# EAGLE design RobomasterHub (EAGLE 9.6.2)
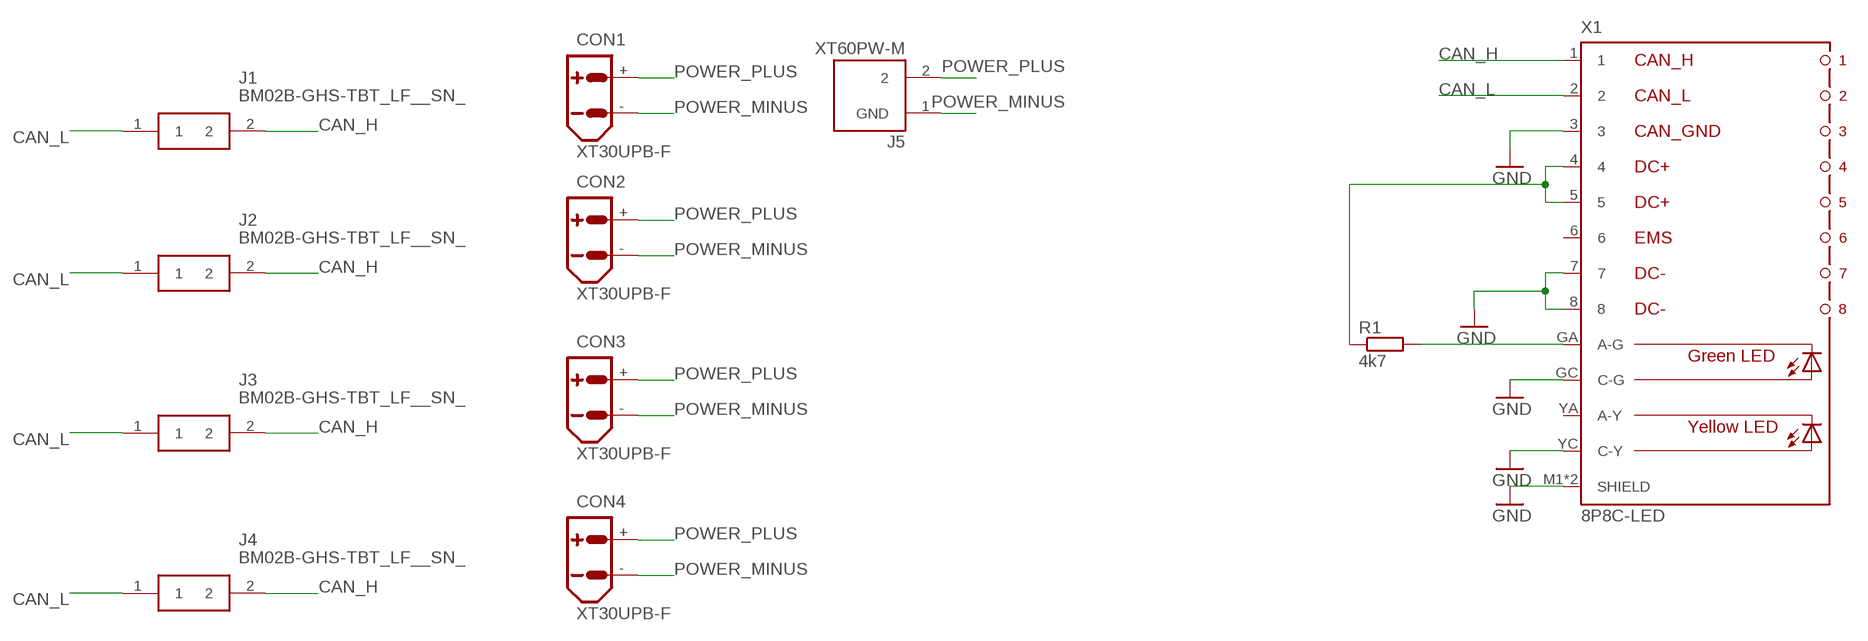
[diagram p0: schematic, sheet 1]

## Parts
CON1  XT30UPB-F  [XT30UPB-F]
CON2  XT30UPB-F  [XT30UPB-F]
CON3  XT30UPB-F  [XT30UPB-F]
CON4  XT30UPB-F  [XT30UPB-F]
J1  BM02B-GHS-TBT_LF__SN_  [BM02B-GHS-TBT_1]
J2  BM02B-GHS-TBT_LF__SN_  [BM02B-GHS-TBT_1]
J3  BM02B-GHS-TBT_LF__SN_  [BM02B-GHS-TBT_1]
J4  BM02B-GHS-TBT_LF__SN_  [BM02B-GHS-TBT_1]
J5  XT60PW-M  [AMASS_XT60PW-M]
R1  4k7  R-EU_R0603  [R0603]
X1  8P8C-LED  [8P8C-LED]

## Nets
CAN_H: J1.2 J2.2 J3.2 J4.2 X1.1
CAN_L: J1.1 J2.1 J3.1 J4.1 X1.2
GND: X1.3 X1.7 X1.8 X1.GC(C-G) X1.M1(SHIELD) X1.M2(SHIELD) X1.YC(C-Y)
N$1: R1.2 X1.GA(A-G)
N$2 [wide]: R1.1 X1.4 X1.5
POWER_MINUS: CON1.- CON2.- CON3.- CON4.- J5.1(GND)
POWER_PLUS: CON1.+ CON2.+ CON3.+ CON4.+ J5.2
Unconnected: X1.6 X1.YA(A-Y)

## Library data of the parts
CON1-CON4 = amass:XT30: AMASS XT30 connector Store in Japan AMASS XT30 connector <https://szc.jp/ams-xt30>
J1-J4 = BM02B-GHS-TBT_LF__SN_:BM02B-GHS-TBT_LF__SN_: GH 1.25mm header top entry 2 way JST GH Series, 1.25mm Pitch 2 Way Shrouded Straight PCB Header, Surface Mount, Solder Termination Source: Datasheet <http://uk.rs-online.com/web/p/products/7521762>; DESCRIPTION: GH 1.25mm header top entry 2 way JST GH Series, 1.25mm Pitch 2 Way Shrouded Straight PCB Header, Surface Mount, Solder Termination; HEIGHT: mm; MANUFACTURER_NAME: JST (JAPAN SOLDERLESS TERMINALS); MANUFACTURER_PART_NUMBER: BM02B-GHS-TBT(LF)(SN)
J5 = con-xt:XT60PW-M; AVAILABILITY: Unavailable; MF: AMASS; MP: XT60PW-M; PACKAGE: Package Analog Devices; PRICE: None
R1 = rcl:R-EU_: RESISTOR, European symbol; SPICEPREFIX: R
X1 = con-rj45:8P8C-LED: generic 8P8C connector with two LED's; OC_FARNELL: unknown; OC_NEWARK: unknown

## Net classes
0 default: width 0.25 mm
1 wide: width 0.5 mm
2 6A: width 1.5 mm

## Board
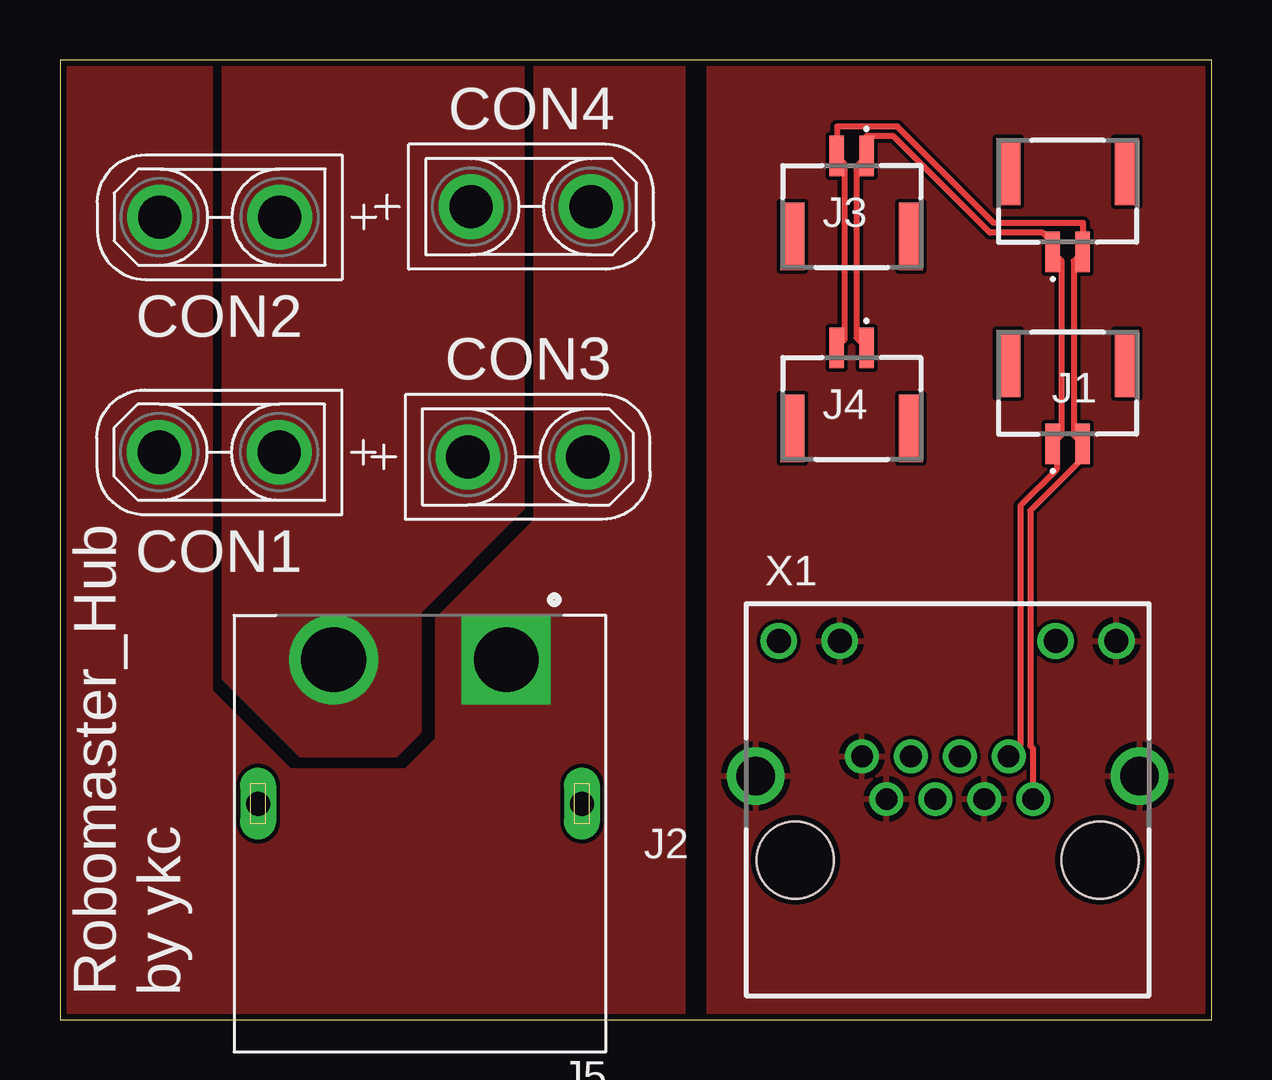
[diagram p1: board, top side]
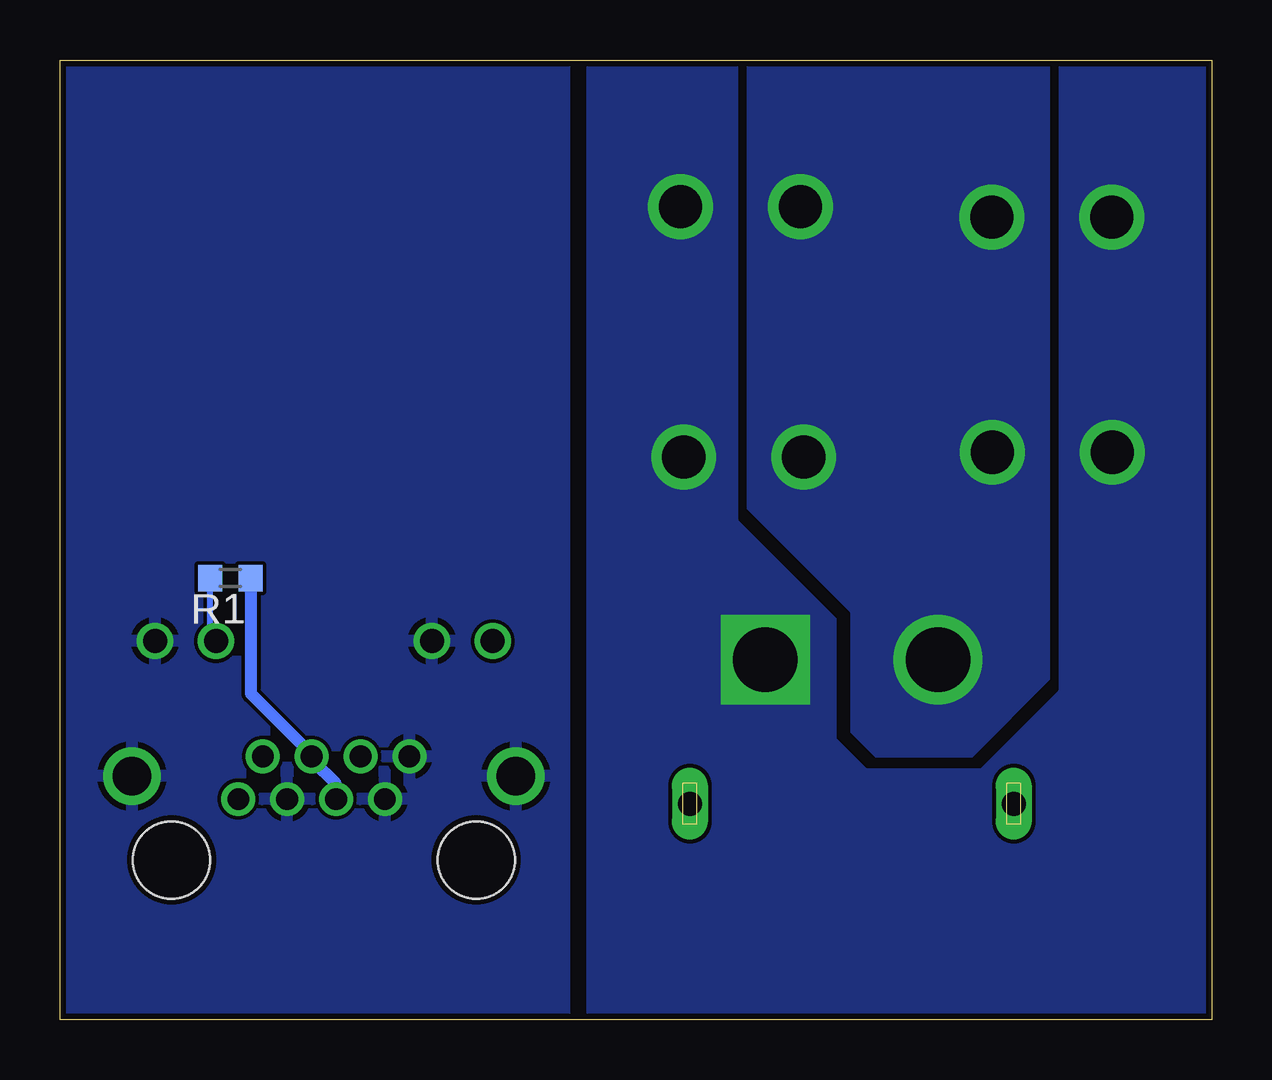
[diagram p2: board, bottom side, seen from below]

Size 48 x 40 mm. Coordinates in mm from the lower left corner, seen from the top.
Outline: 0,0 48,0 48,40 0,40 0,0
Copper layers (1*16): Top 0.035mm / dielectric 1.5mm / Bottom 0.035mm
Design rules "SeeedStudio_2layer_DRU_no_angle_20140221": minimum track width 6mil, minimum drill 12mil, track to track 6mil, track to pad 6mil, pad to pad 6mil, via to via 6mil, smd to smd 0mil, copper to edge 10mil, drill to drill 10mil, minimum pad ring 10mil, minimum via ring 6mil, stop-mask expansion 2mil, vias tented up to drill 100mil, thermal gap 10mil

### Footprints (pad centres in the part's own frame; a part is rotated, then mirrored left to right if it is on the bottom)
XT30UPB-F = drill 1.8: + 2.5,0; - -2.5,0
BM02B-GHS-TBT_1 = smd 0.6 x 1.7: 1 0.625,0; 2 -0.625,0 | smd 1 x 2.8: 3 -2.475,-3.35; 4 2.475,-3.35
AMASS_XT60PW-M = drill 2.7 square: 1 -3.6,-6 | drill 2.7: 2 3.6,-6 | drill 1 pad 1.2 long: S1 -6.75,0; S2 6.75,0
R0603 = smd 1 x 1.1: 1 -0.85,0; 2 0.85,0
8P8C-LED = drill 0.9 pad 1.3: 1 3.57,-3.81; 2 2.55,-2.03; 3 1.53,-3.81; 4 0.51,-2.03; 5 -0.51,-3.81; 6 -1.53,-2.03; 7 -2.55,-3.81; 8 -3.57,-2.03 | drill 1 pad 1.422: GA 4.5,2.78; GC 7.04,2.78; YA -7.04,2.78; YC -4.5,2.78 | drill 1.6 pad 2.184: M1 -8,-2.85; M2 8,-2.85 | hole 3.2: 6.35,-6.35; -6.35,-6.35

### Placement (x,y rotation side)
CON1  6.64,23.65 0 top
CON2  6.66,33.45 0 top
CON3  19.5,23.45 180 top
CON4  19.64,33.88 180 top
J1  42,24 180 top
J2  42,32 180 top
J3  33,36 0 top
J4  33,28 0 top
J5  15,9 180 top
R1  40.9,18.4 180 bottom
X1  37,13 0 top

### Tracks (layer width: path | path; a pad name or v marks a point on that pad's centre or on a via)
CAN_H
  Top 0.25: J4.2 32.69,28.32 32.69,35.68 J3.2 32.39,36.12 32.39,37.22 32.4,37.22 34.91,37.22 38.93,33.2 42.65,33.2 42.65,32.09 J2.2 42.25,31.63 42.25,24.37 J1.2 42.62,23.4 40.44,21.22 40.44,11.42 40.57,11.29 X1.1
CAN_L
  Top 0.25: J4.1 33.22,28.4 33.2,28.46 33.2,35.58 J3.1 33.6,35.91 33.6,36.81 34.75,36.81 38.77,32.8 40.98,32.8 41.38,32.4 J2.1 41.75,31.63 41.75,24.37 J1.1 41.55,23.83 41.55,22.94 40.04,21.43 40.04,11.46 X1.2
GND
  pour Top: 27,40 27,0 48,0 48,40
  pour Bottom: 27,40 27,0 48,0 48,40
N$1
  Bottom 0.25: R1.2 41.75,18.31 41.75,15.99 41.55,15.79 X1.GA
N$2
  Bottom 0.5: R1.1 40.04,18.31 40.04,13.58 37.52,11.07 X1.4 37.42,10.76 36.52,9.86 36.52,9.26 X1.5
POWER_MINUS
  pour Top (no thermals): 6.3,40 6.3,13.7 9.6,10.4 14.4,10.4 15.7,11.7 15.7,16.7 19.8,20.8 19.8,40 26,40 26,0 0,0 0,40
  pour Bottom (no thermals): 0,40 0,0 26,0 26,40 19.8,40 19.8,20.8 15.7,16.7 15.7,11.7 14.4,10.4 9.6,10.4 6.3,13.7 6.3,40
POWER_PLUS
  pour Top (no thermals): 6.8,40 6.8,14.2 10,11 14,11 15,12 15,17 19.3,21.3 19.3,40
  pour Bottom (no thermals): 6.8,40 6.8,14.2 10,11 14,11 15,12 15,17 19.3,21.3 19.3,40

### Text on the board
tPlace: Robomaster_Hub / by ykc